# Altium schematic sheet Copy of ESP32.SchDoc
size 281 x 241 mm; SheetNumber: 1; SheetTotal: 1
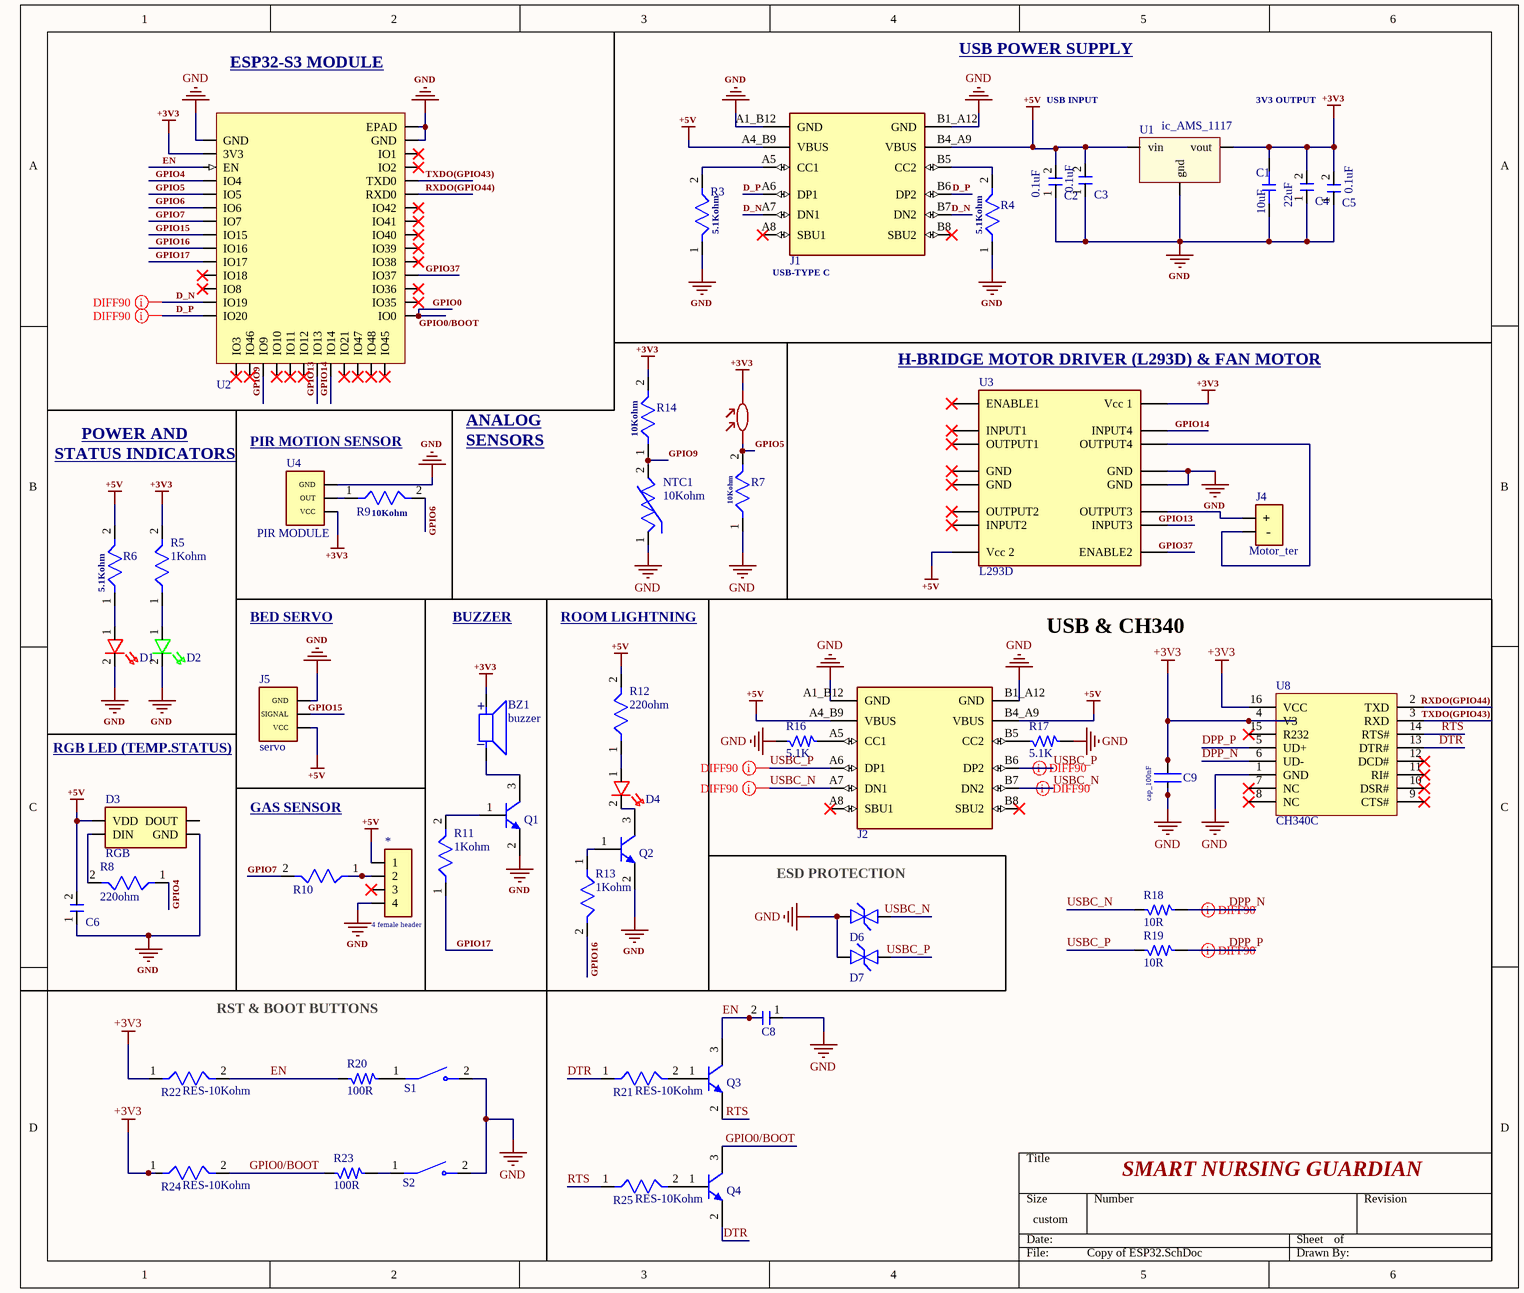
[diagram p0: Copy of ESP32.SchDoc]

## Parts
*  4 female header  [4 female header]
BZ1  buzzer  [buzzer]
C1  10uF  [cap_0805]
C2  0.1uF  [CAPC1608X50N]
C3  0.1uF  [CAPC1608X50N]
C4  22uF  [CAPC2012X125N]
C5  0.1uF  [CAPC1608X50N]
C6  CAP-0.1uF  [CAPC1608X50N]  (value not drawn)
C8  CAP-0.1uF  [CAPC1608X50N]  (value not drawn)
C9  cap_100nF  [CAPC100nf]
D1  RED LED  [RED LED]  (value not drawn)
D2  GREEN LED  [RED LED]  (value not drawn)
D3  RGB  [RGB_LED]
D4  RED LED  [RED LED]  (value not drawn)
D6  D_TVS_BI_0603  [D_0603]  (value not drawn)
D7  D_TVS_BI_0603  [D_0603]  (value not drawn)
J1  USB-TYPE C  [Korean Hroparts Elec TYPE-C-31-M-12]
J2  USB-TYPE C  [Korean Hroparts Elec TYPE-C-31-M-12]  (value not drawn)
J4  Motor_ter  [motor_terminal]
J5  servo  [3 pin header 100 mils]
NTC1  10Kohm  [THERM_NTCG203NH103JT1S]
Q1  MMSS8050-H-TP  [SOT 23-3]  (value not drawn)
Q2  MMSS8050-H-TP  [SOT 23-3]  (value not drawn)
Q3  MMSS8050-H-TP  [SOT 23-3]  (value not drawn)
Q4  MMSS8050-H-TP  [SOT 23-3]  (value not drawn)
R3  5.1Kohm  [RES]
R4  5.1Kohm  [RES]
R5  1Kohm  [RES]
R6  5.1Kohm  [RES]
R7  10Kohm  [RES]
R8  220ohm  [RES]
R9  10Kohm  [RES]
R10  RES-10Kohm  [RES]  (value not drawn)
R11  1Kohm  [RES]
R12  220ohm  [RES]
R13  1Kohm  [RES]
R14  10Kohm  [RES]
R15  gl5539  [XDCR_PDV-P8003]  (value not drawn)
R16  5.1K  [RES_0603]
R17  5.1K  [RES_0603]
R18  10R  [RES_0603]
R19  10R  [RES_0603]
R20  100R  [RES_0603]
R21  RES-10Kohm  [RES]
R22  RES-10Kohm  [RES]
R23  100R  [RES_0603]
R24  RES-10Kohm  [RES]
R25  RES-10Kohm  [RES]
S1  XUNPU TS-1088-AR02016  [XUNPU TS-1088-AR02016]  (value not drawn)
S2  XUNPU TS-1088-AR02016  [XUNPU TS-1088-AR02016]  (value not drawn)
U1  ic_AMS_1117  [ams1117 ic]
U2  ESP32-S3-WROOM-1  [ESP32-S3-WROOM-1]  (value not drawn)
U3  L293D  [l293D]
U4  PIR MODULE  [3 pin header 100 mils]
U8  CH340C  [PCBComponent_1]

## Nets
+3V3: BZ1.P C1.2 C4.2 C5.2 C9.2 R5.2 R14.2 R15.2 R22.1 R24.1 U1.vout U2.2(3V3) U3.16(Vcc_1) U4.1(VCC) U8.4(V3) U8.16(VCC)
+5V: *.1 C2.2 C3.2 C6.2 D3.1(VDD) J1.A4_B9(VBUS) J1.B4_A9(VBUS) J2.A4_B9(VBUS) J2.B4_A9(VBUS) J5.1(VCC) R6.2 R12.2 U1.vin U3.8(Vcc_2)
GND: *.4 C1.1 C2.1 C3.1 C4.1 C5.1 C6.1 C8.1 C9.1 D1.2 D2.2 D3.3(GND) D6.A D7.A J1.A1_B12(GND) J1.B1_A12(GND) J2.A1_B12(GND) J2.B1_A12(GND) J5.3(GND) NTC1.1 Q1.2(E) Q2.2(E) R3.1 R4.1 R7.1 R16.1 R17.2 S1.2 S2.2 U1.gnd U2.1(GND) U2.40(GND) U2.41(EPAD) U3.12(GND) U3.13(GND) U4.3(GND) U8.1(GND)
D_N: J1.A7(DN1) J1.B7(DN2) U2.13(IO19)
D_P: J1.A6(DP1) J1.B6(DP2) U2.14(IO20)
DPP_N: R18.2 U8.6(UD-)
DPP_P: R19.2 U8.5(UD+)
DTR: Q4.2(E) R21.1 U8.13(DTR#)
EN: C8.2 Q3.3(C) R20.1 R22.2 U2.3(EN)
GPIO0: Q4.3(C) R23.1 R24.2 U2.27(IO0)  [also labelled GPIO0/BOOT]
GPIO4: R8.1 U2.4(IO4)
GPIO5: R7.2 R15.1 U2.5(IO5)
GPIO6: R9.2 U2.6(IO6)
GPIO7: R10.2 U2.7(IO7)
GPIO9: NTC1.2 R14.1 U2.17(IO9)
GPIO13: U2.21(IO13) U3.10(INPUT3)
GPIO14: U2.22(IO14) U3.15(INPUT4)
GPIO15: J5.2(SIGNAL) U2.8(IO15)
GPIO16: R13.2 U2.9(IO16)
GPIO17: R11.1 U2.10(IO17)
GPIO37: U2.30(IO37) U3.9(ENABLE2)
RTS: Q3.2(E) R25.1 U8.14(RTS#)
RXDO(GPIO44): U2.36(RXD0) U8.2(TXD)
TXDO(GPIO43): U2.37(TXD0) U8.3(RXD)
USBC_N: D6.K J2.A7(DN1) J2.B7(DN2) R18.1
USBC_P: D7.K J2.A6(DP1) J2.B6(DP2) R19.1
Net*_2: *.2 R10.1
NetBZ1_N: BZ1.N Q1.3(C)
NetD1_1: D1.1 R6.1
NetD2_1: D2.1 R5.1
NetD3_2: D3.2(DIN) R8.2
NetD4_1: D4.1 R12.1
NetD4_2: D4.2 Q2.3(C)
NetJ1_A5: J1.A5(CC1) R3.2
NetJ1_B5: J1.B5(CC2) R4.2
NetJ2_A5: J2.A5(CC1) R16.2
NetJ2_B5: J2.B5(CC2) R17.1
NetJ4_1: J4.1(+) U3.11(OUTPUT3)
NetJ4_2: J4.2(-) U3.14(OUTPUT4)
NetQ1_1: Q1.1(B) R11.2
NetQ2_1: Q2.1(B) R13.1
NetQ3_1: Q3.1(B) R21.2
NetQ4_1: Q4.1(B) R25.2
NetR9_1: R9.1 U4.2(OUT)
NetR20_2: R20.2 S1.1
NetR23_2: R23.2 S2.1

Not connected (* = marked no-connect by the designer): * 3*; D3 4(DOUT); J1 A8(SBU1)* B8(SBU2)*; J2 A8(SBU1)* B8(SBU2)*; U2 11(IO18)* 12(IO8)* 15(IO3)* 16(IO46)* 18(IO10)* 19(IO11)* 20(IO12)* 23(IO21)* 24(IO47)* 25(IO48)* 26(IO45)* 28(IO35)* 29(IO36)* 31(IO38)* 32(IO39)* 33(IO40)* 34(IO41)* 35(IO42)* 38(IO2)* 39(IO1)*; U3 1(ENABLE1)* 2(INPUT1)* 3(OUTPUT1)* 4(GND)* 5(GND)* 6(OUTPUT2)* 7(INPUT2)*; U8 7(NC)* 8(NC)* 9(CTS#)* 10(DSR#)* 11(RI#)* 12(DCD#)* 15(R232)*

## Layout directives
differential pair; differential pair class DIFF90: D_N, D_P, DPP_N, DPP_P, USBC_N, USBC_P

## Notes on the sheet
- ESP32-S3 MODULE
- USB POWER SUPPLY
- USB INPUT
- 3V3 OUTPUT
- (near U3) H-BRIDGE MOTOR DRIVER (L293D) & FAN MOTOR
- ANALOG
- STATUS INDICATORS
- POWER AND
- PIR MOTION SENSOR
- SENSORS
- BED SERVO
- BUZZER
- ROOM LIGHTNING
- USB & CH340
- RGB LED (TEMP.STATUS)
- GAS SENSOR
- (near D6) ESD PROTECTION
- RST & BOOT BUTTONS
- SMART NURSING GUARDIAN
- (in symbol buzzer) +; _

## Library data of the parts
* = 4 female header: CONN SOCKET 4POS 2.54mm SINGLE ROW TH; MFR: BOOMELE(Boom Precision Elec); MPN: 2.54-1*4P; SUPPLIER: LCSC; SUPPLIER PART #: C2718488; ComponentLink1Description: link; ComponentLink1URL: https://www.lcsc.com/product-detail/C2718488.html?s_z=n_q_t_Female%2520Header%25202.54mm&spm=wm.fly.bg.2.stp___wm.ssy.tc.0.tz&lcsc_vid=RwUNAlQEFVQKBl1XEgMNU1FXTwNbUQdRRANXVFFRFVMxVlNeT1JaXldUQlZWUjsOAxUeFF5JWBYZEEoKFBINSQcJGk4NBhADEA4cHktRTlJADxALGw%3D%3D
BZ1 = buzzer: BUZZER MAGNETIC 4V~8V 12mm TH; MFR: Huaneng; MPN: TMB12A05; SUPPLIER: LCSC; SUPPLIER PART #: C96093; ComponentLink1Description: New link; ComponentLink1URL: *
C1 = Cap_10uF: MFR: Samsung Electro-Mechanics; MFR part*: CL21A106KAYNNNE; supplier: *lcsc; supplier part*: C15850; ComponentLink1Description: datasheet; ComponentLink1URL: FgNZXwIFQgRbX1BSE1YMAwJTQFFaV1ACT1lWXwYHElExVlNeQVVaXlRSQFNZVzsOAxUeFF5JWBYZEEoKFBINSQcJGk4NBhADEA4cHktURFVfSQwSGg0
C2 C3 C5 C6 C8 = CAP-0.1uF: CAP CER 100nF 50V X7R 0603; Manufactor: Samsung Electro-Mechanics; MFN: CL10B104KB8NNNC; SPN: C1591; Supplier: LCSC; ComponentLink1Description: New link; ComponentLink1URL: https://www.lcsc.com/product-detail/C1591.html?s_z=n_q_t_Capacitors%25200.1uF&spm=wm.fly.bg.0.cbh___wm.ssy.tc.0.tz&lcsc_vid=FgNZXwIFQgRbX1BSE1YMAwJTQFFaV1ACT1lWXwYHElExVlNeT1NfVlRfT1VbXjsOAxUeFF5JWBYZEEoKFBINSQcJGk4NBhADEA4cHktXRlVcSQwSGg0%3D
C4 = CAP-22uF: CAP CER 22uF 25V X5R 0805; Manufactor: muRata; MFN: GRM21BR61E226ME44L; SPN: C86816; Supplier: LCSC; ComponentLink1Description: New link; ComponentLink1URL: https://www.lcsc.com/product-detail/C86816.html?s_z=n_q_t_Capacitors%252022uF&spm=wm.fly.bg.0.cbh___wm.ssy.tc.2.tz&lcsc_vid=FgNZXwIFQgRbX1BSE1YMAwJTQFFaV1ACT1lWXwYHElExVlNeT1NfVlZVT1FZUTsOAxUeFF5JWBYZEEoKFBINSQcJGk4dAgUUFAk%3D
C9 = cap_100nF: CAP CER 100nF 50V X7R 0805; MFR: Samsung Electro-Mechanics; MPN: CL21B104KBCNNNC; SnapEDA_Link: https://www.snapeda.com/parts/CL21B104KBCNNNC/Samsung/view-part/?ref=snap; Package: SMD-2 Samsung; supplier: lcsc; supplier part #: C1711
D1 D4 = RED LED: LED RED 0603 SMD; Manufactor: YONGYUTAI YLED0603B; MPN: YLED0603B; SPN: C19171390; supplier: LCSC; ComponentLink1Description: New link; ComponentLink1URL: https://www.lcsc.com/product-detail/C19171390.html?s_z=n_q_C19171390&globalKeyword=C19171390
D2 = GREEN LED: LED GREEN WATER CLEAR 0603 SMD; Manufactor: HONGLITRONIC; MPN: PSC-1608U52GC-G4; SPN: C22371297; supplier: LCSC; ComponentLink1Description: New link; ComponentLink1URL: https://www.lcsc.com/product-detail/C22371297.html?s_z=n_q_LED%2520GREEN%25200603%2520SMD&spm=wm.fly.bg.0.cbh&lcsc_vid=RwJaUAYDQFdbVQJWRFldAwZXT1FfBlJXEVZaAgZTTwQxVlNeT1JXVlNXQ1FXXjsOAxUeFF5JWBYZEEoKFBINSQcJGk4eFQsCAgIaSgADAwAHC0slRlhfUFVVTlFADxALGw%3D%3D
D3 = RGB: SMD 5050 Full color RGB LED data transmission frequency up to 800Kbps, with 30 fps refresh rate, 5.00x5.00 mm; MFR: Shenzhen LED Color Optoelectronic Inc.; MPN: SMD-4 Shenzhen LED Color Optoelectronic Inc.; SUPPLIER: LCSC; SUPPLIER PART #: None
D6 = D_TVS_BI_0603: Diode TVS / ESD Bidirectional 0603; Manufacturer: *; Manufacturer Part Number: *
D7 = D_TVS_BI_0603: Diode TVS / ESD Bidirectional 0603; Manufacturer: Nexperia; Manufacturer Part Number: PTVS20VZ1USKYL; supplier: lcsc; supplier part #: C553391
J1 J2 = USB-TYPE C: CONN RCPT Type-C 16POS SMD; manufactor: Korean Hroparts Elec; MPN: TYPE-C-31-M-12; SPN: C165948; supplier: LCSC; ComponentLink1Description: New link; ComponentLink1URL: https://www.lcsc.com/product-detail/C165948.html?s_z=n_q_p_USB%2520TYPE%2520C&spm=wm.ssy.bg.1.cbh&lcsc_vid=RwJaUAYDQFdbVQJWRFldAwZXT1FfBlJXEVZaAgZTTwQxVlNeT1JYUFVVRlNWUDsOAxUeFF5JWBYZEEoKFBINSQcJGk4NBhADEA4cHktXRlhXSQwSGg0%3D
J4 = Motor_ter: TERM BLK 2POS 2.54mm TH; MFR: Molex; MPN: 397730002; SUPPLIER: lcsc; SUPPLIER PART #: C6957573
J5 = FAN/DC MOTOR: MFR: Harwin; MPN: M20-9990346; SUPPLIER: LCSC; SUPPLIER PART #: C5355646
NTC1 = NTCG203NH103JT1S: 10kΩ 440uA 3590K ±5% 200mW ±3% 0805 NTC Thermistors RoHS; manufactor: TDK; SPN: C3153798; MPN: NTCG203NH103JT1S; supplier: LCSC; ComponentLink1Description: New link; ComponentLink1URL: https://www.lcsc.com/product-detail/C3153798.html?s_z=n_q_NTCG203NH103JT1S&spm=wm.fly.bg.0.xh&lcsc_vid=RwJaUAYDQFdbVQJWRFldAwZXT1FfBlJXEVZaAgZTTwQxVlNeT1ZfU1xeQFlfXjsOAxUeFF5JWBYZEEoKFBINSQcJGk4NBhADEA4cHktQRVVADxALGw%3D%3D
Q1-Q4 = TRNS-NPN_25V-1.5A-SOT23: Bipolar (BJT) Transistor NPN 25V 1.5A 100MHz 625mW Surface Mount SOT-23; Manufacturer: MCC; Alternate Part Number-1: NA; Manufacturer Part Number: MMSS8050-H-TP; Case/Package: SOT-23; Supplier-1: MOUSER; Supplier Part Number-1: MMSS8050-H-TP
R3 R4 R6 = RES-5.1Kohm: RES 5.1kΩ ±1% 100mW 0603; Manufactor: FOJAN; MFN: FRC0603F5101TS; SPN: C2907044; supplier: LCSC; ComponentLink1Description: New link; ComponentLink1URL: https://www.lcsc.com/product-detail/C2907044.html?s_z=n_q_t_res%25205.1kohm&spm=wm.fly.bg.0.cbh___wm.ssy.tc.0.tz&lcsc_vid=RwJaUAYDQFdbVQJWRFldAwZXT1FfBlJXEVZaAgZTTwQxVlNeT1JYU1BUT1FdVTsOAxUeFF5JWBYZEEoKFBINSQcJGk4dAgUUFAk%3D
R5 R11 R13 = RES_1Kohm: RES 1kΩ ±1% 100mW 0603; Manufactor: FOJAN; MPN: FRC0603F1001TS; SPN: C2907002; supplier: LCSC; ComponentLink1Description: New link; ComponentLink1URL: https://www.lcsc.com/product-detail/C2907002.html?s_z=n_q_t_RES%25201KOHM&spm=wm.fly.bg.0.cbh___wm.ssy.tc.0.tz&lcsc_vid=RwJaUAYDQFdbVQJWRFldAwZXT1FfBlJXEVZaAgZTTwQxVlNeT1JXVVRQQVBZUzsOAxUeFF5JWBYZEEoKFBINSQcJGk4NBhADEA4cHktSRlNADxALGw%3D%3D
R7 R9 R10 R14 R21 R22 R24 R25 = RES-10Kohm: RES 10kΩ ±1% 100mW 0603; Manufactor: YAGEO; MFN: RC0603FR-0710KL; SPN: C98220; supplier: LCSC; ComponentLink1Description: New link; ComponentLink1URL: https://www.lcsc.com/product-detail/C98220.html?s_z=n_q_t_RESISTOR%252010K%25CE%25A9&spm=wm.fly.bg.0.cbh___wm.ssy.tc.0.tz&lcsc_vid=FgNZXwIFQgRbX1BSE1YMAwJTQFFaV1ACT1lWXwYHElExVlNeT1NeXlZQRVRWVjsOAxUeFF5JWBYZEEoKFBINSQcJGk4NBhADEA4cHktXRlhXSQwSGg0%3D
R8 R12 = RES_220ohm: RES 220Ω ±1% 100mW 0603; Manufactor: UNI-ROYAL; MPN: 0603WAF2200T5E; SPN: C22962; supplier: LCSC; ComponentLink1Description: New link; ComponentLink1URL: https://www.lcsc.com/product-detail/C22962.html?s_z=n_q_t_res%2520220ohm&spm=wm.fly.bg.0.cbh___wm.ssy.tc.0.tz&lcsc_vid=RwJaUAYDQFdbVQJWRFldAwZXT1FfBlJXEVZaAgZTTwQxVlNeT1ddUFRWT1BZXzsOAxUeFF5JWBYZEEoKFBINSQcJGk4eFQsCAgIaSgADAwAHC0slRlhfUFVVTlVADxALGw%3D%3D
R15 = gl5539: Dark Resistance:10MΩ Cell Resistance @ Illuminance:50kΩ~100kΩ Cell Resistance @ Illuminance:50kΩ~100kΩ Voltage - Max:150V Wavelength - Peak:540nm Rise Time:20ms Fall Time:30ms Operating Temperature:-30℃~+70℃ Operating Temperature:-30℃~+70℃ γ Value:0.8; Manufacturer: 森霸; AddInBom: yes; ModelId: 50a77439f2ea4df19a538b7b9a8c09e6; ModelName: RES-TH_L5.1-W4.3-P3.40-D0.5; ModelTransform: 169.291,200.39669,0,0,0,0,-3.937,0,-137.795; Dark Resistance: 10MΩ; Voltage - Max: 150V; Wavelength - Peak: 540nm; Rise Time: 20ms; Fall Time: 30ms; γ Value: 0.8; Symbol: GL5539; LCSC Part Name: GL5539; SupplierPart: C125630; ManufacturerPart: GL5539; Supplier Footprint: 插件,P=3mm; JLCPCB Part Class: Extended Part; Datasheet: https://item.szlcsc.com/datasheet/GL5539/136908.html; Supplier: LCSC; ConvertToPcb: yes; FootprintName: RES-TH_L5.1-W4.3-P3.40-D0.5; Cell Resistance @ Illuminance: 50kΩ~100kΩ; Operating Temperature: -30℃~+70℃
R16 R17 = RES_4.7K-0.1W-1%-0603: 4.7 kOhms ±1% 0.1W, 1/10W Chip Resistor 0603 (1608 Metric) Moisture Resistant Thick Film; Manufacturer: Walsin; Manufacturer Part Number: WR06X4701FTL; Alternate Part Number-1: MR06X4701FTL; Case/Package: 0603; Supplier-1: SIRICOM; Supplier Part Number-1: WR06X4701FTL
R18 R19 = RES_10R-0.1W-1%-0603: 10 Ohms ±1% 0.1W, 1/10W Chip Resistor 0603 (1608 Metric) Automotive AEC-Q200, Moisture Resistant Thick Film; Manufacturer: Walsin; Manufacturer Part Number: WR06X10R0FTL; Alternate Part Number-1: RS-03K10R0FT; Case/Package: 0603; Supplier-1: SIRICOM; Supplier Part Number-1: WR06X10R0FTL
R20 R23 = RES_100R-0.1W-1%-0603: 100 Ohms ±1% 0.1W, 1/10W Chip Resistor 0603 (1608 Metric) Thick Film; Manufacturer: Walsin; Manufacturer Part Number: WR06X1000FTL; Alternate Part Number-1: MR06X1000FTL; Case/Package: 0603; Supplier-1: SIRICOM; Supplier Part Number-1: WALSIN:WR06X1000FTL
S1 S2 = XUNPU TS-1088-AR02016: SWITCH TACTILE SPST 160gf SMD; SPN: C720477; manufactor: XUNPU; MPN: TS-1088-AR02016; supplier: LCSC; ComponentLink1Description: New link; ComponentLink1URL: https://www.lcsc.com/product-detail/C720477.html?s_z=n_q_t_SWITCH&spm=wm.fly.bg.0.cbh___wm.ssy.tc.0.tz&lcsc_vid=FgNZXwIFQgRbX1BSE1YMAwJTQFFaV1ACT1lWXwYHElExVlNeT1BXX11UT1dfVzsOAxUeFF5JWBYZEEoKFBINSQcJGk4NBhADEA4cHktRTlVADxALGw%3D%3D
U1 = ic_AMS_1117: 1A Low Dropout (LDO) Regulator; mfr: Advanced Monolithic Systems; mfr part #: AMS1117-3.3; supplier: lcsc; supplier part #: C6186; ComponentLink1Description: datasheet; ComponentLink1URL: https://www.lcsc.com/datasheet/C6186.pdf?spm=wm.sxq.inf.ggs___wm.fly.bg.0.stp&lcsc_vid=T1lZAgUDR1VfUABTElhaXgZfQFVcUgYHQwJZX1ZTQFAxVlNeQVJeUFFeTlhYUDsOAxUeFF5JWBYZEEoKFBINSQcJGk4NBhADEA4cHktSR1hADxALGw%3D%3D
U2 = ESP32-S3-WROOM-1: 2.4 GHz Wi-Fi + Bluetooth + Bluetooth LE module; Manufactor: ESPRESSIF; MFN: ESP32-WROOM-32E-N4; SPN: C701341; supplier: LCSC; ComponentLink1Description: LCSC link; ComponentLink1URL: *
U3 = L293D: Bipolar Motor Driver - Parallel 16-PowerDIP; MFR: ST; SUP PART #: C12340; MPN: L293D; SUPPLIER: LCSC; ComponentLink1Description: ink; ComponentLink1URL: https://www.lcsc.com/product-detail/C12340.html?s_z=s_p_t_L293D&spm=wm.fly.bg.1.xh___wm.ssy.tc.0.tz&lcsc_vid=RwUNAlQEFVQKBl1XEgMNU1FXTwNbUQdRRANXVFFRFVMxVlNeT1NZUVRWTllfVjsOAxUeFF5JWBYZEEoKFBINSQcJGk4eFQsCAgIaSgADAwAHC0slT1RWU1RIHxUDCw%3D%3D
U4 = 3 PIN HEADER 100mils pitch: MFR: Harwin; MPN: M20-9990346; SUPPLIER: LCSC; SUPPLIER PART #: C5355646
U8 = IC_CH340C: USB Bridge, USB to UART USB 2.0 UART Interface; Manufacturer: Olimex; Alternate Part Number-1: NA; Manufacturer Part Number: CH340C; Case/Package: SOIC16; Supplier-1: LCSC; Supplier Part Number-1: C84681